# Altium schematic sheet BSPD.SchDoc
size A4
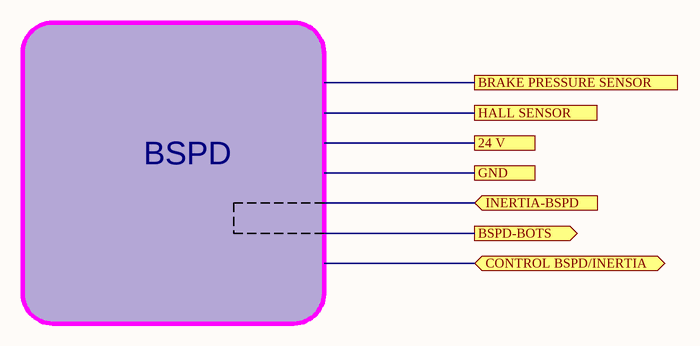
[diagram p0: BSPD.SchDoc]

## Ports
24 V, BRAKE PRESSURE SENSOR, BSPD-BOTS (out), CONTROL BSPD/INERTIA (bidir), GND, HALL SENSOR, INERTIA-BSPD (in)

## Notes on the sheet
- BSPD